# Altium project unisat_top_hw.PrjPCB
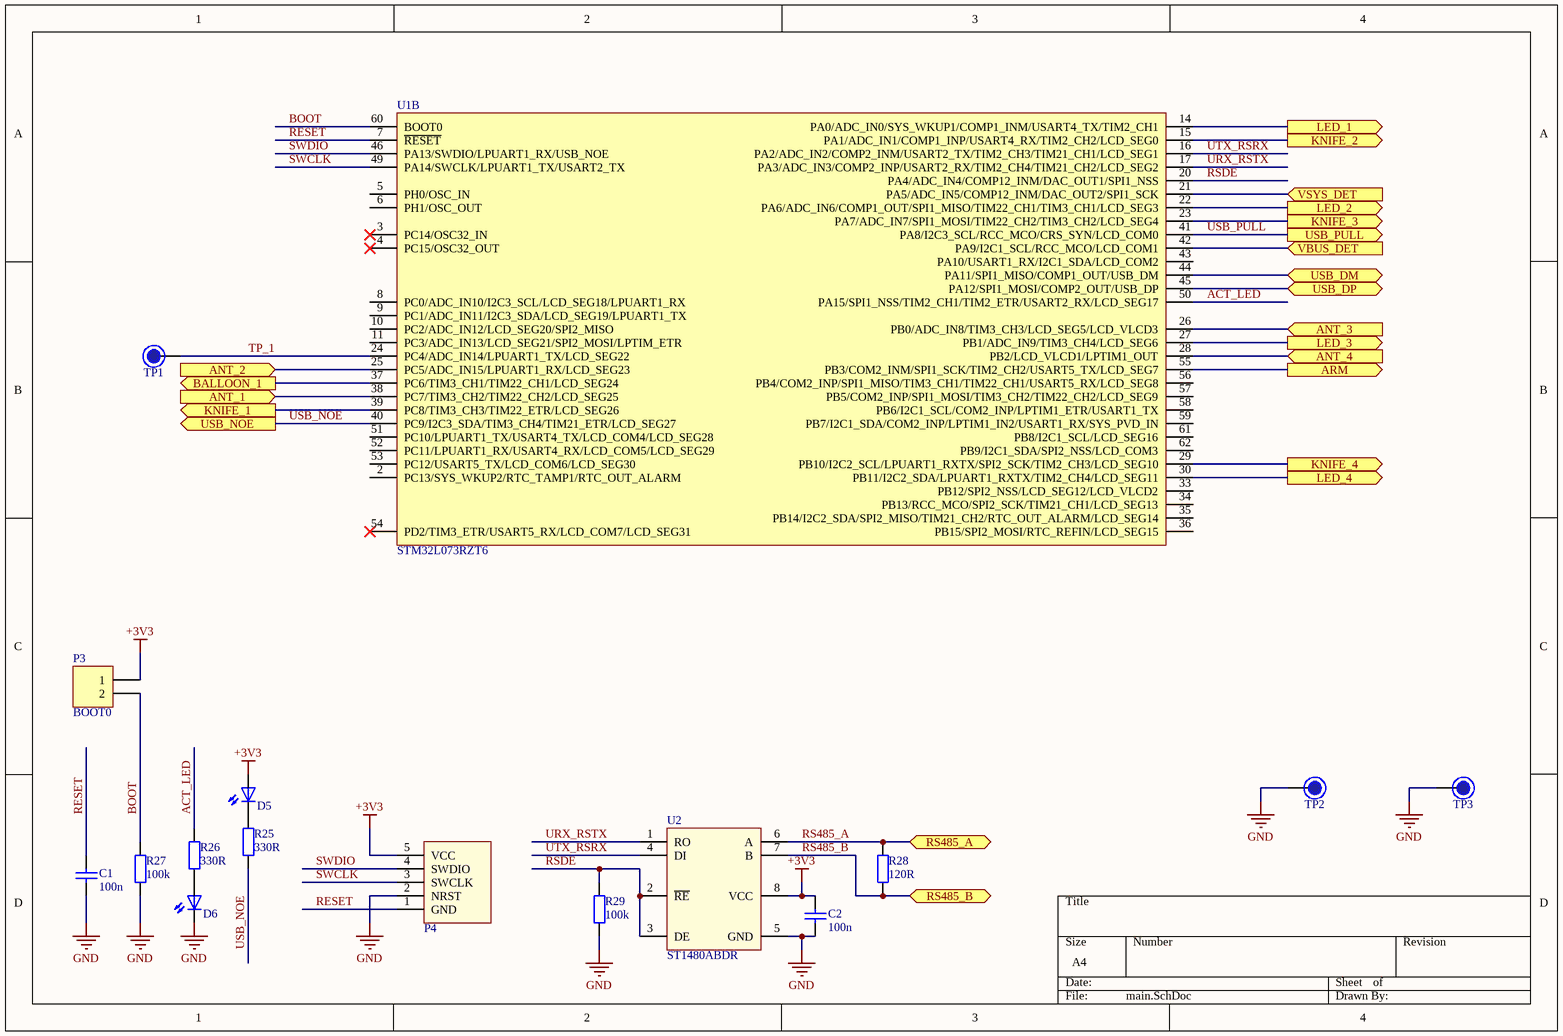
[diagram p0: main.SchDoc]
hwver: v03
4 sheets, 96 parts. Net scope: flat (ports and power ports of the same name join across sheets).
Board file: unisat_top.PcbDoc
Sheets:
  main.SchDoc
  pwr_system.SchDoc
  led_system.SchDoc
  balloon_system.SchDoc

## Sheet main.SchDoc
size A4

### Parts
C1  100n  [C0603_IPC_MD]
C2  100n  [C0603_IPC_MD]
D5  LTST-C190GKT  [LED_0603]  (value not drawn)
D6  LTST-C190GKT  [LED_0603]  (value not drawn)
P3  BOOT0  [HDR1X2]  (no BOM)
P4  SWD  [SWD_CON_VAR2]  (value not drawn)  (no BOM)
R25  330R  [R0603_IPC_MD]
R26  330R  [R0603_IPC_MD]
R27  100k  [R0603_IPC_MD]
R28  120R  [R0603_IPC_MD]
R29  100k  [R0603_IPC_MD]
TP1  Test Point  [TestPoint_1M5]  (value not drawn)  (no BOM)
TP2  GND  [TestPoint_1M5_TH]  (value not drawn)  (no BOM)
TP3  GND  [TestPoint_1M5_TH]  (value not drawn)  (no BOM)
U1  STM32L073RZT6  [LQFP64_10X10MM]  (part B of 2)
U2  ST1480ABDR  [SOIC-8]

### Ports
ANT_1 (in), ANT_2 (in), ANT_3 (in), ANT_4 (in), ARM (out), BALLOON_1 (out), KNIFE_1 (out), KNIFE_2 (out), KNIFE_3 (out), KNIFE_4 (out), LED_1 (out), LED_2 (out), LED_3 (out), LED_4 (out), RS485_A (bidir), RS485_B (bidir), USB_DM (bidir), USB_DP (bidir), USB_NOE (out), USB_PULL (out), VBUS_DET (in), VSYS_DET (in)

### Nets
+3V3: C2.2 D5.2(A) P3.1 P4.5(VCC) U2.8(VCC)
GND: C1.1 C2.1 D6.1(C) P4.2(NRST) R27.1 R29.1 TP2.0 TP3.0 U2.5(GND)
ACT_LED: R26.1 U1.50(PA15/SPI1_NSS/TIM2_CH1/TIM2_ETR/USART2_RX/LCD_SEG17)
ARM: U1.55(PB3/COM2_INM/SPI1_SCK/TIM2_CH2/USART5_TX/LCD_SEG7) ; port ARM
BALLOON_1: U1.37(PC6/TIM3_CH1/TIM22_CH1/LCD_SEG24) ; port BALLOON_1
BOOT: P3.2 R27.2 U1.60(BOOT0)
LED_1: U1.14(PA0/ADC_IN0/SYS_WKUP1/COMP1_INM/USART4_TX/TIM2_CH1) ; port LED_1
LED_2: U1.22(PA6/ADC_IN6/COMP1_OUT/SPI1_MISO/TIM22_CH1/TIM3_CH1/LCD_SEG3) ; port LED_2
LED_3: U1.27(PB1/ADC_IN9/TIM3_CH4/LCD_SEG6) ; port LED_3
LED_4: U1.30(PB11/I2C2_SDA/LPUART1_RXTX/TIM2_CH4/LCD_SEG11) ; port LED_4
RESET: C1.2 P4.1(GND) U1.7(~{RESET})
RS485_A: R28.2 U2.6(A) ; port RS485_A
RS485_B: R28.1 U2.7(B) ; port RS485_B
RSDE: R29.2 U1.20(PA4/ADC_IN4/COMP12_INM/DAC_OUT1/SPI1_NSS) U2.2(~{RE}) U2.3(DE)
SWCLK: P4.3(SWCLK) U1.49(PA14/SWCLK/LPUART1_TX/USART2_TX)
SWDIO: P4.4(SWDIO) U1.46(PA13/SWDIO/LPUART1_RX/USB_NOE)
TP_1: TP1.0 U1.24(PC4/ADC_IN14/LPUART1_TX/LCD_SEG22)
URX_RSTX: U1.17(PA3/ADC_IN3/COMP2_INP/USART2_RX/TIM2_CH4/TIM21_CH2/LCD_SEG2) U2.1(RO)
USB_DM: U1.44(PA11/SPI1_MISO/COMP1_OUT/USB_DM) ; port USB_DM
USB_DP: U1.45(PA12/SPI1_MOSI/COMP2_OUT/USB_DP) ; port USB_DP
USB_NOE: R25.2 U1.40(PC9/I2C3_SDA/TIM3_CH4/TIM21_ETR/LCD_SEG27) ; port USB_NOE
USB_PULL: U1.41(PA8/I2C3_SCL/RCC_MCO/CRS_SYN/LCD_COM0) ; port USB_PULL
UTX_RSRX: U1.16(PA2/ADC_IN2/COMP2_INM/USART2_TX/TIM2_CH3/TIM21_CH1/LCD_SEG1) U2.4(DI)
VBUS_DET: U1.42(PA9/I2C1_SCL/RCC_MCO/LCD_COM1) ; port VBUS_DET
VSYS_DET: U1.21(PA5/ADC_IN5/COMP12_INM/DAC_OUT2/SPI1_SCK) ; port VSYS_DET
NetD5_1: D5.1(C) R25.1
NetD6_2: D6.2(A) R26.2
NetU1_15: U1.15(PA1/ADC_IN1/COMP1_INP/USART4_RX/TIM2_CH2/LCD_SEG0) ; port KNIFE_2
NetU1_23: U1.23(PA7/ADC_IN7/SPI1_MOSI/TIM22_CH2/TIM3_CH2/LCD_SEG4) ; port KNIFE_3
NetU1_25: U1.25(PC5/ADC_IN15/LPUART1_RX/LCD_SEG23) ; port ANT_2
NetU1_26: U1.26(PB0/ADC_IN8/TIM3_CH3/LCD_SEG5/LCD_VLCD3) ; port ANT_3
NetU1_28: U1.28(PB2/LCD_VLCD1/LPTIM1_OUT) ; port ANT_4
NetU1_29: U1.29(PB10/I2C2_SCL/LPUART1_RXTX/SPI2_SCK/TIM2_CH3/LCD_SEG10) ; port KNIFE_4
NetU1_38: U1.38(PC7/TIM3_CH2/TIM22_CH2/LCD_SEG25) ; port ANT_1
NetU1_39: U1.39(PC8/TIM3_CH3/TIM22_ETR/LCD_SEG26) ; port KNIFE_1

Not connected (* = marked no-connect by the designer): U1 2(PC13/SYS_WKUP2/RTC_TAMP1/RTC_OUT_ALARM) 3(PC14/OSC32_IN)* 4(PC15/OSC32_OUT)* 5(PH0/OSC_IN) 6(PH1/OSC_OUT) 8(PC0/ADC_IN10/I2C3_SCL/LCD_SEG18/LPUART1_RX) 9(PC1/ADC_IN11/I2C3_SDA/LCD_SEG19/LPUART1_TX) 10(PC2/ADC_IN12/LCD_SEG20/SPI2_MISO) 11(PC3/ADC_IN13/LCD_SEG21/SPI2_MOSI/LPTIM_ETR) 33(PB12/SPI2_NSS/LCD_SEG12/LCD_VLCD2) 34(PB13/RCC_MCO/SPI2_SCK/TIM21_CH1/LCD_SEG13) 35(PB14/I2C2_SDA/SPI2_MISO/TIM21_CH2/RTC_OUT_ALARM/LCD_SEG14) 36(PB15/SPI2_MOSI/RTC_REFIN/LCD_SEG15) 43(PA10/USART1_RX/I2C1_SDA/LCD_COM2) 51(PC10/LPUART1_TX/USART4_TX/LCD_COM4/LCD_SEG28) 52(PC11/LPUART1_RX/USART4_RX/LCD_COM5/LCD_SEG29) 53(PC12/USART5_TX/LCD_COM6/LCD_SEG30) 54(PD2/TIM3_ETR/USART5_RX/LCD_COM7/LCD_SEG31)* 56(PB4/COM2_INP/SPI1_MISO/TIM3_CH1/TIM22_CH1/USART5_RX/LCD_SEG8) 57(PB5/COM2_INP/SPI1_MOSI/TIM3_CH2/TIM22_CH2/LCD_SEG9) 58(PB6/I2C1_SCL/COM2_INP/LPTIM1_ETR/USART1_TX) 59(PB7/I2C1_SDA/COM2_INP/LPTIM1_IN2/USART1_RX/SYS_PVD_IN) 61(PB8/I2C1_SCL/LCD_SEG16) 62(PB9/I2C1_SDA/SPI2_NSS/LCD_COM3)

### Library data of the parts
C1 C2 = CL10B104KO8NNNC: CAP CER 0.1UF 16V X7R 0603; Manufacturer: Samsung Electro-Mechanics; Manufacturer Part Number: CL10B104KO8NNNC; Voltage: 16V; Value: 100n; Dielectric: X7R; Supplier 1: Digi-Key; Supplier Part Number 1: 1276-1005-1-ND
D5 D6 = LTST-C190GKT: LED GREEN CLEAR CHIP SMD 0603; Manufacturer: Lite-On Inc.; Manufacturer Part Number: LTST-C190GKT; Color: Green; Supplier 1: Digi-Key; Supplier Part Number 1: 160-1183-1-ND
P3 = Header 2: Header, 2-Pin; LatestRevisionDate: 17-Jul-2002; LatestRevisionNote: Re-released for DXP Platform.; Publisher: Altium Limited
P4 = SWD-CONNECTOR_VAR1: SWDIO SWCLK VDD GND NRST; Manufacturer: *; Manufacturer Part Number: *; Supplier 1: *; Supplier Part Number 1: *
R25 R26 = CR0603-JW-331ELF: RES SMD 330 OHM 5% 1/10W 0603; Manufacturer: Bourns Inc.; Value: 330R; Tolarance: 5%; Manufacturer Part Number: CR0603-JW-331ELF; Supplier 1: Digi-Key; Supplier Part Number 1: CR0603-JW-331ELFCT-ND
R27 R29 = RMCF0603FT100K: RES 100K OHM 1% 1/10W 0603; Manufacturer: Bourns Inc.; Value: 100k; Tolarance: 1%; Manufacturer Part Number: RMCF0603FT100K; Supplier 1: Digi-Key; Supplier Part Number 1: RMCF0603FT100KCT-ND
R28 = RC0603JR-07120RL: RES SMD 120 OHM 5% 1/10W 0603; Manufacturer: Yageo; Value: 120R; Tolarance: 5%; Manufacturer Part Number: RC0603JR-07120RL; Supplier 1: Digi-Key; Supplier Part Number 1: 311-120GRCT-ND
TP1 = TP
TP2 TP3 = TP: Test Point
U1 = STM32L073RZT6: Ultra-low-power 32-bit MCU ARM®-based Cortex®-M0+; Manufacturer: ST; SRAM: 20KB; FLASH: 192KB; Manufacturer Part Number: STM32L073RZT6; Supplier 1: Digi-Key; Supplier Part Number 1: 497-16270-ND
U2 = ST1480ABDR: IC TXRX 3.3V RS485/422 8 SOIC; Manufacturer: STMicroelectronics; Manufacturer Part Number: ST1480ABDR; Supplier 1: Digi-Key; Supplier Part Number 1: 497-2046-1-ND

## Sheet pwr_system.SchDoc
size A4; Revision: A
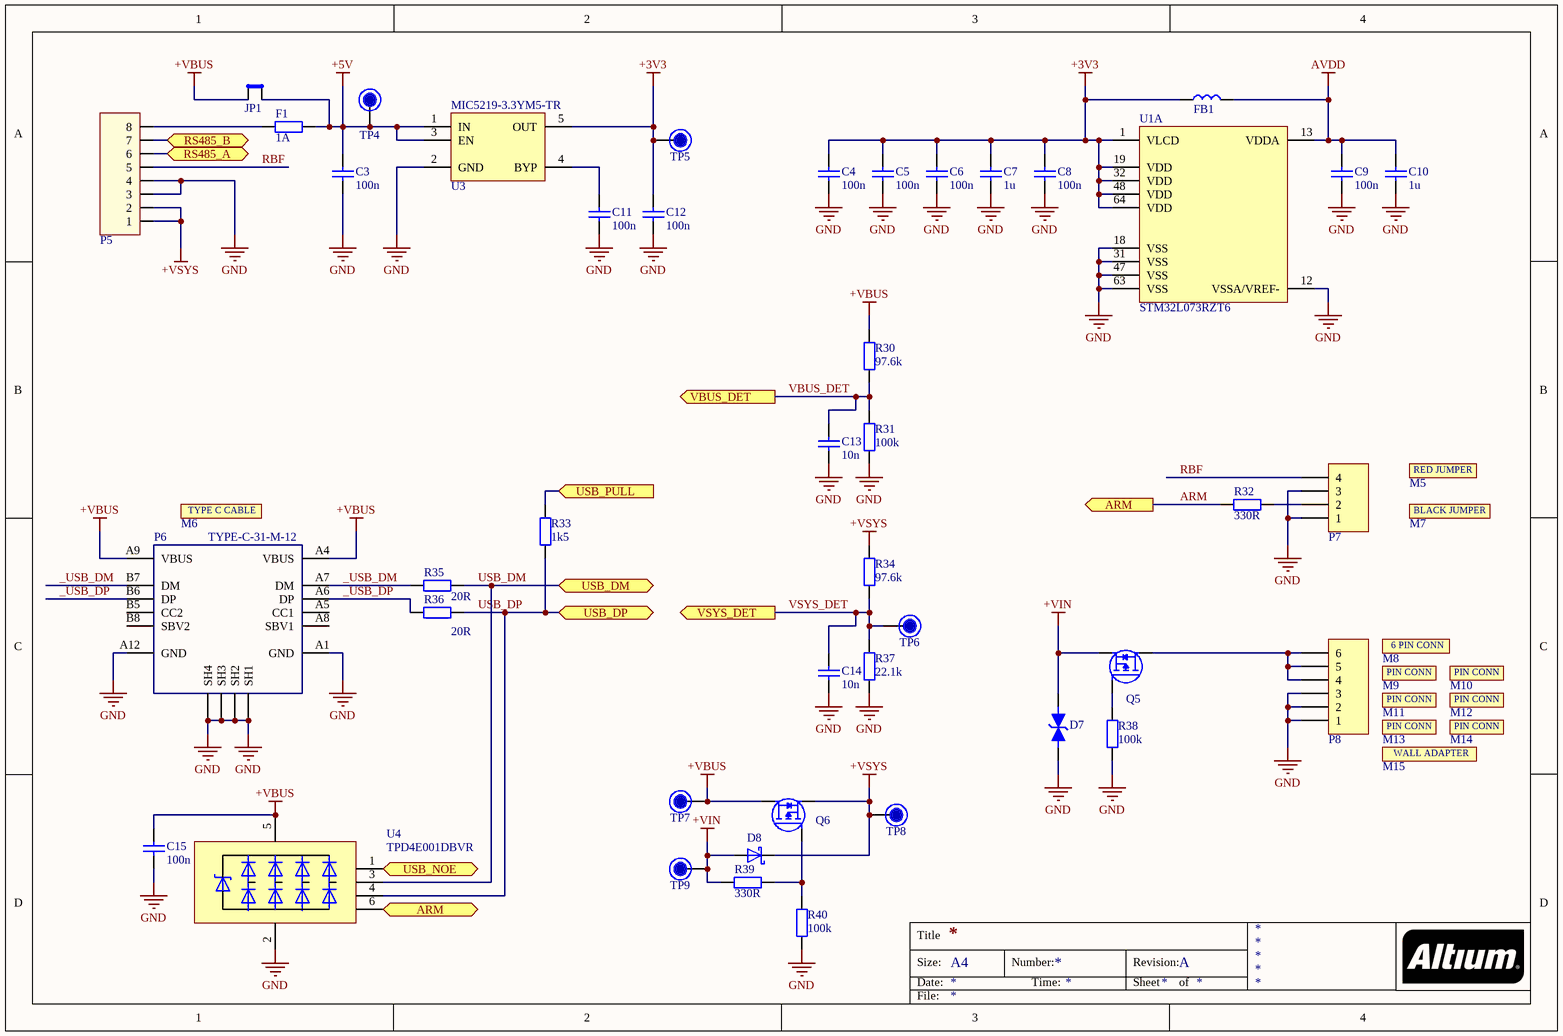
[diagram p1: pwr_system.SchDoc]

### Parts
C3  100n  [C0603_IPC_MD]
C4  100n  [C0603_IPC_MD]
C5  100n  [C0603_IPC_MD]
C6  100n  [C0603_IPC_MD]
C7  1u  [C0603_IPC_MD]
C8  100n  [C0603_IPC_MD]
C9  100n  [C0603_IPC_MD]
C10  1u  [C0603_IPC_MD]
C11  100n  [C0603_IPC_MD]
C12  100n  [C0603_IPC_MD]
C13  10n  [C0603_IPC_MD]
C14  10n  [C0603_IPC_MD]
C15  100n  [C0603_IPC_MD]
D7  824501121  [DIOM4227X25N]  (value not drawn)
D8  B540C-13-F  [DO-214AB(SMC)]  (value not drawn)
F1  1A  [R0603_IPC_MD]
FB1  MH1608-601Y  [L0603_IPC_MD]  (value not drawn)
JP1  Jumper  [SolderHump1]  (value not drawn)  (no BOM)
M5  2-881545-2  (value not drawn)  (mechanical)
M6  UGREEN-PVC-TYPE-C  (value not drawn)  (mechanical)
M7  STC02SYAN  (value not drawn)  (mechanical)
M8  M20-1060600  (value not drawn)  (mechanical)
M9  M20-1160042  (value not drawn)  (mechanical)
M10  M20-1160042  (value not drawn)  (mechanical)
M11  M20-1160042  (value not drawn)  (mechanical)
M12  M20-1160042  (value not drawn)  (mechanical)
M13  M20-1160042  (value not drawn)  (mechanical)
M14  M20-1160042  (value not drawn)  (mechanical)
M15  SWI10-12-E-P5  (value not drawn)  (mechanical)
P5  PicoBlade_8V  [PB_53398-0871]  (value not drawn)
P6  TYPE-C-31-M-12  [TYPE-C-C165948]
P7  A2541WR-4P  [PLS-1-4]  (value not drawn)
P8  A2541WR-6P  [PLS-1-6]  (value not drawn)
Q5  SISH625DN-T1-GE3  [SISH625DN]  (value not drawn)
Q6  SISH625DN-T1-GE3  [SISH625DN]  (value not drawn)
R30  97.6k  [R0603_IPC_MD]
R31  100k  [R0603_IPC_MD]
R32  330R  [R0603_IPC_MD]
R33  1k5  [R0603_IPC_MD]
R34  97.6k  [R0603_IPC_MD]
R35  20R  [R0805_IPC_MD]
R36  20R  [R0805_IPC_MD]
R37  22.1k  [R0603_IPC_MD]
R38  100k  [R0603_IPC_MD]
R39  330R  [R0603_IPC_MD]
R40  100k  [R0603_IPC_MD]
TP4  5V  [TestPoint_1M5]  (value not drawn)  (no BOM)
TP5  3V3  [TestPoint_1M5]  (value not drawn)  (no BOM)
TP6  VADC  [TestPoint_1M5]  (value not drawn)  (no BOM)
TP7  VBUS  [TestPoint_1M5]  (value not drawn)  (no BOM)
TP8  VSYS  [TestPoint_1M5]  (value not drawn)  (no BOM)
TP9  VIN  [TestPoint_1M5]  (value not drawn)  (no BOM)
U1  STM32L073RZT6  [LQFP64_10X10MM]  (part A of 2)
U3  MIC5219-3.3YM5-TR  [SOT23-5_(MT)]
U4  TPD4E001DBVR  [SOT23-6]

### Ports
ARM (in), ARM (out), RS485_A (bidir), RS485_B (bidir), USB_DM (bidir), USB_DP (bidir), USB_NOE (in), USB_PULL (in), VBUS_DET (out), VSYS_DET (out)

### Nets
+3V3: C4.2 C5.2 C6.2 C7.2 C8.2 C12.1 FB1.1 TP5.0 U1.1(VLCD) U1.19(VDD) U1.32(VDD) U1.48(VDD) U1.64(VDD) U3.5(OUT)
+5V: C3.1 F1.2 JP1.2 TP4.0 U3.1(IN) U3.3(EN)
+VBUS: C15.2 JP1.1 P6.A4(VBUS) P6.A9(VBUS) Q6.3(D) R30.2 TP7.0 U4.5(VCC)
+VIN: D7.2 D8.2(A) Q5.1(S) R39.2 TP9.0
+VSYS: D8.1(C) P5.1 P5.2 Q6.1(S) R34.2 TP8.0
AVDD: C9.2 C10.2 FB1.2 U1.13(VDDA)
GND: C3.2 C4.1 C5.1 C6.1 C7.1 C8.1 C9.1 C10.1 C11.2 C12.2 C13.1 C14.1 C15.1 D7.1 P5.3 P5.4 P6.A1(GND) P6.A12(GND) P6.SH1 P6.SH2 P6.SH3 P6.SH4 P7.1 P7.3 P8.1 P8.2 P8.3 R31.2 R37.1 R38.2 R40.2 U1.12(VSSA/VREF-) U1.18(VSS) U1.31(VSS) U1.47(VSS) U1.63(VSS) U3.2(GND) U4.2(GND)
_USB_DM: P6.A7(DM) P6.B7(DM) R35.1
_USB_DP: P6.A6(DP) P6.B6(DP) R36.1
ARM: R32.1 U4.6(IO4) ; port ARM
RBF: P5.5 P7.4
RS485_A: P5.6 ; port RS485_A
RS485_B: P5.7 ; port RS485_B
USB_DM: R35.2 U4.3(IO2) ; port USB_DM
USB_DP: R33.1 R36.2 U4.4(IO3) ; port USB_DP
USB_NOE: U4.1(IO1) ; port USB_NOE
USB_PULL: R33.2 ; port USB_PULL
VBUS_DET: C13.2 R30.1 R31.1 ; port VBUS_DET
VSYS_DET: C14.2 R34.1 R37.2 TP6.0 ; port VSYS_DET
NetC11_1: C11.1 U3.4(BYP)
NetF1_1: F1.1 P5.8
NetP7_2: P7.2 R32.2
NetP8_4: P8.4 P8.5 P8.6 Q5.3(D)
NetQ5_2: Q5.2(G) R38.1
NetQ6_2: Q6.2(G) R39.1 R40.1

Not connected (* = marked no-connect by the designer): P6 A5(CC1) A8(SBV1) B5(CC2) B8(SBV2)

### Notes on the sheet
- Title
- Size:
- Date:
- A4
- Number:
- Time:
- Revision:
- Sheet
- of
- File:
- (in symbol 2-881545-2) RED JUMPER
- (in symbol M20-1060600) 6 PIN CONN
- (in symbol M20-1160042) PIN CONN
- (in symbol STC02SYAN) BLACK JUMPER
- (in symbol SWI10-12-E-P5) WALL ADAPTER
- (in symbol TYPE-C-CABLE) TYPE C CABLE

### Library data of the parts
C3-C6 C8 C9 C11 C12 C15 = CL10B104KO8NNNC: as C1 on sheet main; Manufacturer Part Number: CL10B104KO8NNNC; Voltage: 16V; Value: 100n; Dielectric: X7R; Supplier 1: Digi-Key; Supplier Part Number 1: 1276-1005-1-ND
C7 C10 = CL10B105MO8NNWC: CAP CER 1UF 16V X7R 0603; Manufacturer: Samsung Electro-Mechanics; Manufacturer Part Number: CL10B105MO8NNWC; Voltage: 16V; Value: 1u; Dielectric: X7R; Supplier 1: Digi-Key; Supplier Part Number 1: 1276-6524-1-ND
C13 C14 = CL10B103KB8NNNC: CAP CER 0.01UF 50V X7R 0603; Manufacturer: Samsung Electro-Mechanics; Manufacturer Part Number: CL10B103KB8NNNC; Voltage: 50V; Value: 10n; Dielectric: X7R; Supplier 1: Digi-Key; Supplier Part Number 1: 1276-1009-1-ND
D7 = 824501121_TVS: TVS DIODE 12V 19.9V DO214AC; Manufacturer: Wurth Electronics Inc.; Voltage - Reverse Standoff (Typ): 12V (Max); Current - Average Rectified (Io): 1A; Manufacturer Part Number: 824501121; Supplier 1: Digi-Key; Supplier Part Number 1: 732-9949-1-ND
D8 = B540C-13-F: DIODE SCHOTTKY 40V 5A DO214AB; Manufacturer: Diodes Inc.; Manufacturer Part Number: B540C-13-F; Supplier 1: Digi-Key; Supplier Part Number 1: B540C-FDICT-ND; Current: 5A
F1 = MFU0603FF01000P500: FUSE BOARD MOUNT 1A 32VDC 0603; Manufacturer: Bourns Inc.; Value: 1A; Manufacturer Part Number: MFU0603FF01000P500; Supplier 1: Digi-Key; Supplier Part Number 1: 749-1742-1-ND
FB1 = MH1608-601Y: FERRITE BEAD 600R@100MHz 0603 for Power Line, 1000mA; Manufacturer: Bourns Inc.; Manufacturer Part Number: MH1608-601Y; Supplier 1: Digi-Key; Supplier Part Number 1: MH1608-601YCT-ND
JP1 = Jumper: Jumper 2.54mm 1 pos; Manufacturer: *; Manufacturer Part Number: *
M5 = 2-881545-2: CONN POST SHUNT NOVO 2POS; Manufacturer: Sullins Connector Solutions; Manufacturer Part Number: 2-881545-2; Supplier 1: Digi-Key; Supplier Part Number 1: 2-881545-2-ND
M6 = TYPE-C-CABLE: Ugreen USB Type C Cable; Manufacturer: China; Manufacturer Part Number: UGREEN-PVC-TYPE-C; Supplier 1: Aliexpress; Supplier Part Number 1: UGREEN-PVC-TYPE-C; Link: https://www.aliexpress.com/item/32421088643.html?spm=2114.12010612.8148356.8.24b5310anwdN5o
M7 = STC02SYAN: CONN JUMPER SHORTING TIN; Manufacturer: Sullins Connector Solutions; Manufacturer Part Number: STC02SYAN; Supplier 1: Digi-Key; Supplier Part Number 1: S9000-ND
M8 = M20-1060600: CONN RCPT HSG 6POS 2.54MM; Manufacturer: Harwin Inc.; Manufacturer Part Number: M20-1060600; Supplier 1: Digi-Key; Supplier Part Number 1: 952-2231-ND
M9-M14 = M20-1160042: CONN SOCKET 22-30AWG CRIMP GOLD; Manufacturer: Harwin Inc.; Manufacturer Part Number: M20-1160042; Supplier 1: Digi-Key; Supplier Part Number 1: 952-2157-1-ND
M15 = SWI10-12-E-P5: AC/DC WALL MOUNT ADAPTER 12V 10W; Manufacturer: CUI Inc.; Manufacturer Part Number: SWI10-12-E-P5; Supplier 1: Digi-Key; Supplier Part Number 1: 102-4135-ND
P5 = PicoBlade_8V: Connector Header Surface Mount, Right Angle 8 position 0.049" (1.25mm); Manufacturer: China; Manufacturer Part Number: PicoBlade_8V; Supplier 1: Aliexpress; Supplier Part Number 1: PicoBlade_8V
P6 = TYPE-C-31-M-12: TYPE C PCB TH CONN; Manufacturer: Korean Hroparts Elec; Manufacturer Part Number: TYPE-C-31-M-12; Supplier 1: LCSC; Supplier Part Number 1: C165948
P7 = A2541WR-4P: Pin Header / Female Header 0.100"（2.54mm） Plugin P=2.54mm RoHS; Manufacturer: Changjiang Connectors; Manufacturer Part Number: A2541WR-4P; Supplier 1: LCSC; Supplier Part Number 1: C225490
P8 = A2541WR-6P: Pin Header / Female Header 0.100"（2.54mm） Plugin P=2.54mm RoHS; Manufacturer: Changjiang Connectors; Manufacturer Part Number: A2541WR-6P; Supplier 1: LCSC; Supplier Part Number 1: C225492
Q5 Q6 = SISH625DN-T1: P-Channel 30V 17.3A (Ta), 35A (Tc) 3.7W (Ta), 52W (Tc) Surface Mount PowerPAK® 1212-8SH; Manufacturer: Vishay Siliconix; Manufacturer Part Number: SISH625DN-T1-GE3; Supplier 1: Digi-Key; Supplier Part Number 1: SISH625DN-T1-GE3CT-ND
R30 R34 = RC0603FR-0797K6L: RES SMD 97.6K OHM 1% 1/10W 0603; Manufacturer: Yageo; Value: 97.6k; Tolarance: 1%; Manufacturer Part Number: RC0603FR-0797K6L; Supplier 1: Digi-Key; Supplier Part Number 1: 311-97.6KHRCT-ND
R31 R38 R40 = RMCF0603FT100K: as R27 on sheet main; Value: 100k; Tolarance: 1%; Manufacturer Part Number: RMCF0603FT100K; Supplier 1: Digi-Key; Supplier Part Number 1: RMCF0603FT100KCT-ND
R32 R39 = CR0603-JW-331ELF: as R25 on sheet main; Value: 330R; Tolarance: 5%; Manufacturer Part Number: CR0603-JW-331ELF; Supplier 1: Digi-Key; Supplier Part Number 1: CR0603-JW-331ELFCT-ND
R33 = RC0603JR-071K5L: RES SMD 1.5K OHM 5% 1/10W 0603; Manufacturer: Yageo; Value: 1k5; Tolarance: 5%; Manufacturer Part Number: RC0603JR-071K5L; Supplier 1: Digi-Key; Supplier Part Number 1: 311-1.5KGRCT-ND
R35 R36 = RC0805JR-0720RL: RES SMD 20 OHM 5% 1/8W 0805; Manufacturer: Yageo; Value: 20R; Tolarance: 5%; Manufacturer Part Number: RC0805JR-0720RL; Supplier 1: Digi-Key; Supplier Part Number 1: 311-20ARDKR-ND
R37 = RC0603FR-0722K1L: RES SMD 22.1K OHM 1% 1/10W 0603; Manufacturer: Yageo; Value: 22.1k; Tolarance: 1%; Manufacturer Part Number: RC0603FR-0722K1L; Supplier 1: Digi-Key; Supplier Part Number 1: 311-22.1KHRCT-ND
TP4-TP9 = TP: Test Point
U1 = STM32L073RZT6: as U1 on sheet main; Manufacturer Part Number: STM32L073RZT6; Supplier 1: Digi-Key; Supplier Part Number 1: 497-16270-ND
U3 = MIC5219-3.3YM5-TR: IC REG LINEAR 3.3V 500MA SOT23-5; Manufacturer: Microchip Technology; Manufacturer Part Number: MIC5219-3.3YM5-TR; Supplier 1: Digi-Key; Supplier Part Number 1: 576-1281-1-ND
U4 = TPD4E001DBVR: 4x TVS DIODE 5.5V SOT23-6; Manufacturer: TI; Manufacturer Part Number: TPD4E001DBVR; Supplier 1: Digi-Key; Supplier Part Number 1: 296-28203-1-ND

## Sheet led_system.SchDoc
size A4
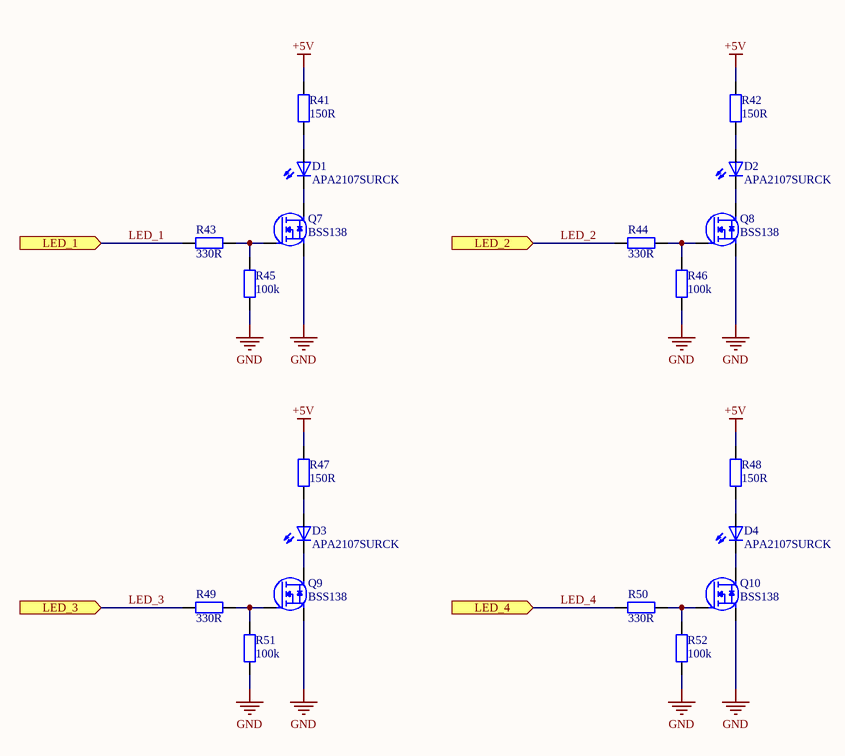
[diagram p2: led_system.SchDoc]

### Parts
D1  APA2107SURCK  [LED_0805_RA_INV]
D2  APA2107SURCK  [LED_0805_RA]
D3  APA2107SURCK  [LED_0805_RA_INV]
D4  APA2107SURCK  [LED_0805_RA]
Q7  BSS138  [SOT23]
Q8  BSS138  [SOT23]
Q9  BSS138  [SOT23]
Q10  BSS138  [SOT23]
R41  150R  [R0603_IPC_MD]
R42  150R  [R0603_IPC_MD]
R43  330R  [R0603_IPC_MD]
R44  330R  [R0603_IPC_MD]
R45  100k  [R0603_IPC_MD]
R46  100k  [R0603_IPC_MD]
R47  150R  [R0603_IPC_MD]
R48  150R  [R0603_IPC_MD]
R49  330R  [R0603_IPC_MD]
R50  330R  [R0603_IPC_MD]
R51  100k  [R0603_IPC_MD]
R52  100k  [R0603_IPC_MD]

### Ports
LED_1 (in), LED_2 (in), LED_3 (in), LED_4 (in)

### Nets
+5V: R41.2 R42.2 R47.2 R48.2
GND: Q7.2(S) Q8.2(S) Q9.2(S) Q10.2(S) R45.2 R46.2 R51.2 R52.2
LED_1: R43.2 ; port LED_1
LED_2: R44.2 ; port LED_2
LED_3: R49.2 ; port LED_3
LED_4: R50.2 ; port LED_4
NetD1_1: D1.1(C) Q7.3(D)
NetD1_2: D1.2(A) R41.1
NetD2_1: D2.1(C) Q8.3(D)
NetD2_2: D2.2(A) R42.1
NetD3_1: D3.1(C) Q9.3(D)
NetD3_2: D3.2(A) R47.1
NetD4_1: D4.1(C) Q10.3(D)
NetD4_2: D4.2(A) R48.1
NetQ7_1: Q7.1(G) R43.1 R45.1
NetQ8_1: Q8.1(G) R44.1 R46.1
NetQ9_1: Q9.1(G) R49.1 R51.1
NetQ10_1: Q10.1(G) R50.1 R52.1

### Library data of the parts
D1-D4 = APA2107SURCK: LED RED CLEAR SMD R/A; Manufacturer: Kingbright; Manufacturer Part Number: APA2107SURCK; Color: Red; Supplier 1: Digi-Key; Supplier Part Number 1: 754-2099-1-ND
Q7-Q10 = BSS138: N-Channel Logic Level Enhancement Mode Field Effect Transistor; Manufacturer: Diodes Incorporated; Manufacturer Part Number: BSS138; Supplier 1: Digi-Key; Supplier Part Number 1: BSS138-FDICT-ND
R41 R42 R47 R48 = RMCF0603FT150R: RES 150 OHM 1% 1/10W 0603; Manufacturer: Stackpole Electronics Inc; Value: 150R; Tolarance: 1%; Manufacturer Part Number: RMCF0603FT150R; Supplier 1: Digi-Key; Supplier Part Number 1: RMCF0603FT150RCT-ND
R43 R44 R49 R50 = CR0603-JW-331ELF: as R25 on sheet main; Value: 330R; Tolarance: 5%; Manufacturer Part Number: CR0603-JW-331ELF; Supplier 1: Digi-Key; Supplier Part Number 1: CR0603-JW-331ELFCT-ND
R45 R46 R51 R52 = RMCF0603FT100K: as R27 on sheet main; Value: 100k; Tolarance: 1%; Manufacturer Part Number: RMCF0603FT100K; Supplier 1: Digi-Key; Supplier Part Number 1: RMCF0603FT100KCT-ND

## Sheet balloon_system.SchDoc
size A4
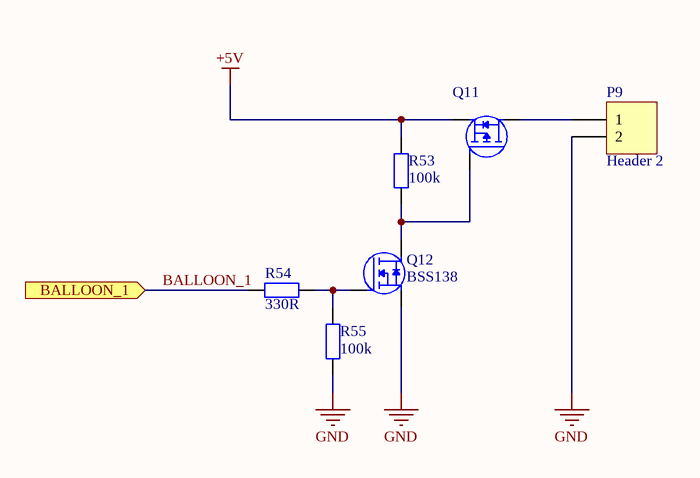
[diagram p3: balloon_system.SchDoc]

### Parts
P9  Header 2  [HDR1X2]  (no BOM)
Q11  SISH625DN-T1-GE3  [SISH625DN]  (value not drawn)  (no BOM)
Q12  BSS138  [SOT23]  (no BOM)
R53  100k  [R0603_IPC_MD]  (no BOM)
R54  330R  [R0603_IPC_MD]  (no BOM)
R55  100k  [R0603_IPC_MD]  (no BOM)

### Ports
BALLOON_1 (in)

### Nets
+5V: Q11.1(S) R53.1
GND: P9.2 Q12.2(S) R55.2
BALLOON_1: R54.2 ; port BALLOON_1
NetP9_1: P9.1 Q11.3(D)
NetQ11_2: Q11.2(G) Q12.3(D) R53.2
NetQ12_1: Q12.1(G) R54.1 R55.1

### Library data of the parts
P9 = Header 2: Header, 2-Pin; LatestRevisionDate: 17-Jul-2002; LatestRevisionNote: Re-released for DXP Platform.; Publisher: Altium Limited
Q11 = SISH625DN-T1: as Q5 on sheet pwr_system; Manufacturer Part Number: SISH625DN-T1-GE3; Supplier 1: Digi-Key; Supplier Part Number 1: SISH625DN-T1-GE3CT-ND
Q12 = BSS138: as Q7 on sheet led_system; Manufacturer Part Number: BSS138; Supplier 1: Digi-Key; Supplier Part Number 1: BSS138-FDICT-ND
R53 R55 = RMCF0603FT100K: as R27 on sheet main; Value: 100k; Tolarance: 1%; Manufacturer Part Number: RMCF0603FT100K; Supplier 1: Digi-Key; Supplier Part Number 1: RMCF0603FT100KCT-ND
R54 = CR0603-JW-331ELF: as R25 on sheet main; Value: 330R; Tolarance: 5%; Manufacturer Part Number: CR0603-JW-331ELF; Supplier 1: Digi-Key; Supplier Part Number 1: CR0603-JW-331ELFCT-ND

## Nets that join several sheets
+3V3: main (5 pins), pwr_system (14 pins)
+5V: pwr_system (6 pins), led_system (R41.2 R42.2 R47.2 R48.2), balloon_system (Q11.1 R53.1)
GND: main (9 pins), pwr_system (38 pins), led_system (8 pins), balloon_system (P9.2 Q12.2 R55.2)
ARM: main (U1.55), pwr_system (R32.1 U4.6)
BALLOON_1: main (U1.37), balloon_system (R54.2)
LED_1: main (U1.14), led_system (R43.2)
LED_2: main (U1.22), led_system (R44.2)
LED_3: main (U1.27), led_system (R49.2)
LED_4: main (U1.30), led_system (R50.2)
RS485_A: main (R28.2 U2.6), pwr_system (P5.6)
RS485_B: main (R28.1 U2.7), pwr_system (P5.7)
USB_DM: main (U1.44), pwr_system (R35.2 U4.3)
USB_DP: main (U1.45), pwr_system (R33.1 R36.2 U4.4)
USB_NOE: main (R25.2 U1.40), pwr_system (U4.1)
USB_PULL: main (U1.41), pwr_system (R33.2)
VBUS_DET: main (U1.42), pwr_system (C13.2 R30.1 R31.1)
VSYS_DET: main (U1.21), pwr_system (C14.2 R34.1 R37.2 TP6.0)